# Altium schematic sheet Channel.SchDoc: Wprowadź Tytuł
size A4; CheckedBy: Wprowadź sprawdzającego; CompanyName: Politechnika Warszawska; DrawnBy: Wprowadź autora; Organization: Koło Naukowe Robotyków; Address1: Nowowiejska 24; Address2: 00-001; Address3: Warszawa; Address4: Polska; Revision: V*.*; DrawnDate: 10.10.20; CheckDate: 10.10.20; ProjectName: Nazwa Projektu
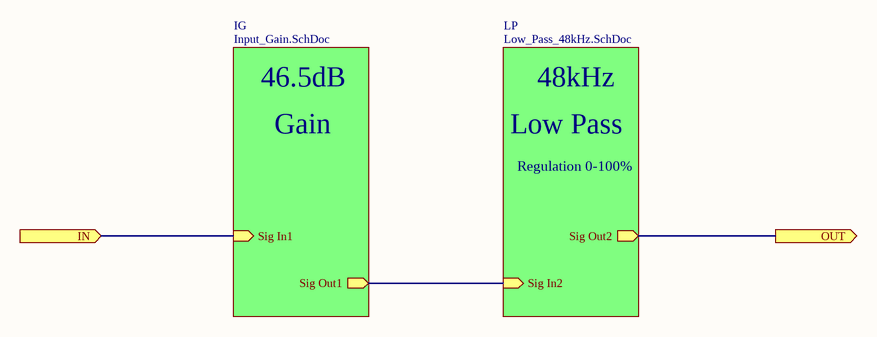
[diagram p0: Channel.SchDoc]

## Sub-sheets
IG = Input_Gain.SchDoc: Sig In1 (in), Sig Out1 (out)
LP = Low_Pass_48kHz.SchDoc: Sig In2 (in), Sig Out2 (out)

## Ports
IN (in), OUT (out)

## Nets
IN: port IN, sheet IG/Sig In1
OUT: port OUT, sheet LP/Sig Out2
(unnamed): sheet IG/Sig Out1, sheet LP/Sig In2

## Notes on the sheet
- 46.5dB
- Gain
- Low Pass
- 48kHz
- Regulation 0-100%
- Project
- Rev.
- Title
- Drawn by
- Date
- Sheet
- of
- Checked by